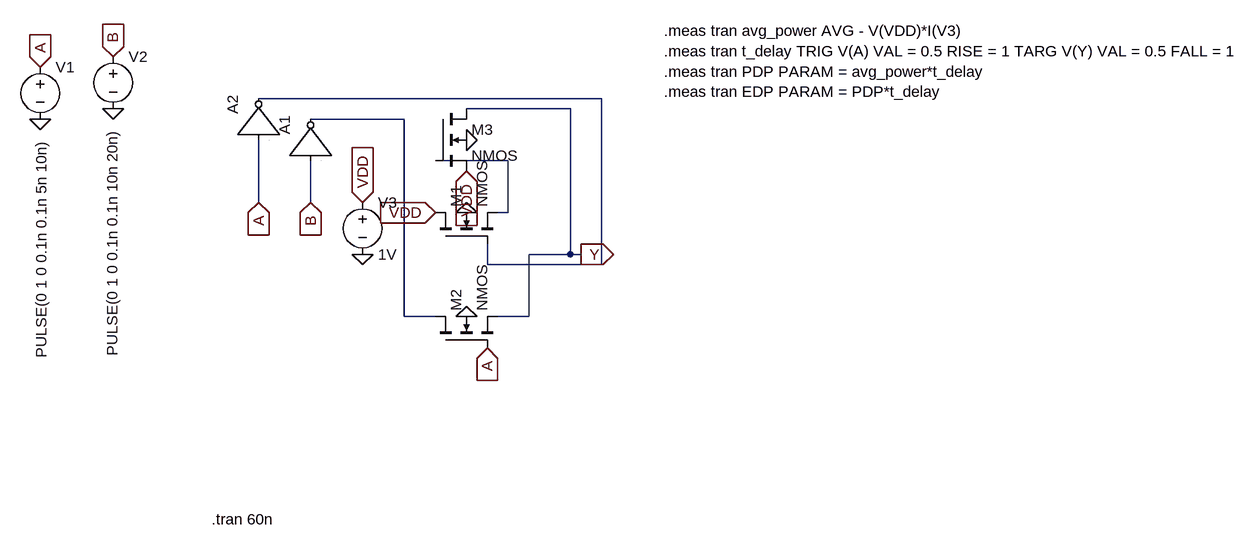
[diagram p0: schematic ptllll.asc]
ptllll.asc, the LTspice schematic file:
Version 4
SHEET 1 1536 680
WIRE 464 -96 -64 -96
WIRE 416 -80 256 -80
WIRE 160 -64 16 -64
WIRE 320 0 208 0
WIRE -64 64 -64 -32
WIRE 16 64 16 0
WIRE 320 80 320 0
WIRE 320 80 304 80
WIRE 416 144 416 -80
WIRE 416 144 352 144
WIRE 432 144 416 144
WIRE 288 160 288 128
WIRE 464 160 464 -96
WIRE 464 160 288 160
WIRE 160 240 160 -64
WIRE 208 240 160 240
WIRE 352 240 352 144
WIRE 352 240 304 240
FLAG 256 80 0
FLAG 256 240 0
FLAG -400 -64 0
FLAG -288 -80 0
FLAG 96 144 0
FLAG -400 -144 A
IOPIN -400 -144 In
FLAG -288 -160 B
IOPIN -288 -160 In
FLAG 96 64 VDD
IOPIN 96 64 In
FLAG 288 288 A
IOPIN 288 288 In
FLAG 432 144 Y
IOPIN 432 144 Out
FLAG -64 64 A
IOPIN -64 64 In
FLAG 16 64 B
IOPIN 16 64 In
FLAG 256 16 VDD
IOPIN 256 16 In
FLAG 256 -32 0
FLAG 208 80 VDD
IOPIN 208 80 In
SYMBOL nmos4 208 128 R270
SYMATTR InstName M1
SYMBOL nmos4 208 288 R270
SYMATTR InstName M2
SYMBOL voltage -400 -160 R0
WINDOW 3 2 127 VRight 2
WINDOW 123 0 0 Left 0
WINDOW 39 0 0 Left 0
SYMATTR Value PULSE(0 1 0 0.1n 0.1n 5n 10n)
SYMATTR InstName V1
SYMBOL voltage -288 -176 R0
WINDOW 3 -1 126 VRight 2
WINDOW 123 0 0 Left 0
WINDOW 39 0 0 Left 0
SYMATTR Value PULSE(0 1 0 0.1n 0.1n 10n 20n)
SYMATTR InstName V2
SYMBOL voltage 96 48 R0
WINDOW 123 0 0 Left 0
WINDOW 39 0 0 Left 0
SYMATTR InstName V3
SYMATTR Value 1V
SYMBOL Digital\\inv -48 0 R270
SYMATTR InstName A1
SYMBOL Digital\\inv -128 -32 R270
SYMATTR InstName A2
SYMBOL nmos4 208 -80 R0
SYMATTR InstName M3
TEXT -136 552 Left 2 !.tran 60n
TEXT 560 -200 Left 2 !.meas tran avg_power AVG - V(VDD)*I(V3)\n.meas tran t_delay TRIG V(A) VAL = 0.5 RISE = 1 TARG V(Y) VAL = 0.5 FALL = 1\n.meas tran PDP PARAM = avg_power*t_delay \n.meas tran EDP PARAM = PDP*t_delay

The netlist it stands for:
* ptllll.asc
M1 VDD N001 N003 0 NMOS
M2 N002 A Y 0 NMOS
V1 A 0 PULSE(0 1 0 0.1n 0.1n 5n 10n)
V2 B 0 PULSE(0 1 0 0.1n 0.1n 10n 20n)
V3 VDD 0 1V
A1 B 0 0 0 0 N002 0 0 BUF
A2 A 0 0 0 0 N001 0 0 BUF
M3 Y N003 VDD 0 NMOS
.model NMOS NMOS
.model PMOS PMOS
.lib standard.mos
.tran 60n
.meas tran avg_power AVG - V(VDD)*I(V3)
.meas tran t_delay TRIG V(A) VAL = 0.5 RISE = 1 TARG V(Y) VAL = 0.5 FALL = 1
.meas tran PDP PARAM = avg_power*t_delay
.meas tran EDP PARAM = PDP*t_delay
.backanno
.end